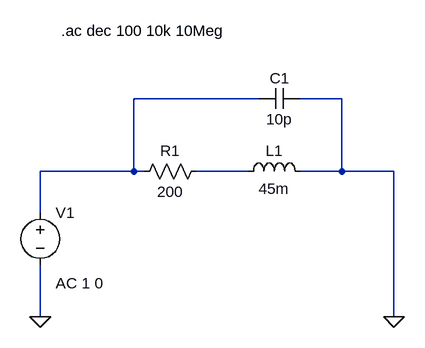
[diagram p0: schematic inductor_model.asc]
inductor_model.asc, the LTspice schematic file:
Version 4
SHEET 1 880 680
WIRE 160 48 -32 48
WIRE 288 48 224 48
WIRE -32 160 -32 48
WIRE -32 160 -176 160
WIRE -16 160 -32 160
WIRE 144 160 64 160
WIRE 288 160 288 48
WIRE 288 160 224 160
WIRE 368 160 288 160
WIRE -176 224 -176 160
WIRE -176 384 -176 304
WIRE 368 384 368 160
FLAG -176 384 0
FLAG 368 384 0
SYMBOL ind 128 176 R270
WINDOW 0 32 56 VTop 2
WINDOW 3 5 56 VBottom 2
SYMATTR InstName L1
SYMATTR Value 45m
SYMBOL res 80 144 R90
WINDOW 0 0 56 VBottom 2
WINDOW 3 32 56 VTop 2
SYMATTR InstName R1
SYMATTR Value 200
SYMBOL cap 224 32 R90
WINDOW 0 0 32 VBottom 2
WINDOW 3 32 32 VTop 2
SYMATTR InstName C1
SYMATTR Value 10p
SYMBOL voltage -176 208 R0
WINDOW 123 24 124 Left 2
WINDOW 39 0 0 Left 0
SYMATTR InstName V1
SYMATTR Value ""
SYMATTR Value2 AC 1 0
TEXT -144 -56 Left 2 !.ac dec 100 10k 10Meg

The netlist it stands for:
* inductor_model.asc
L1 N002 0 45m
R1 N002 N001 200
C1 0 N001 10p
V1 N001 0 AC 1 0
.ac dec 100 10k 10Meg
.backanno
.end